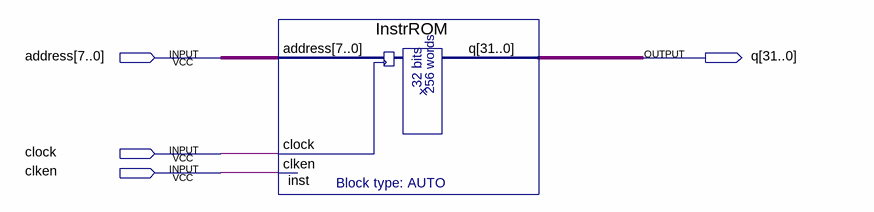
[diagram p0: schematic sheet]
// Quartus schematic comROM.bdf as structural Verilog: 1 symbols, 4 pins
module comROM (
  input  [7:0] address,
  input  clock,
  input  clken,
  output [31:0] q
);

  InstrROM inst (.address(address), .clock(clock), .clken(clken), .q(q));
endmodule
